# Altium schematic sheet PAGE03_机场端单片机.SchDoc
size A4
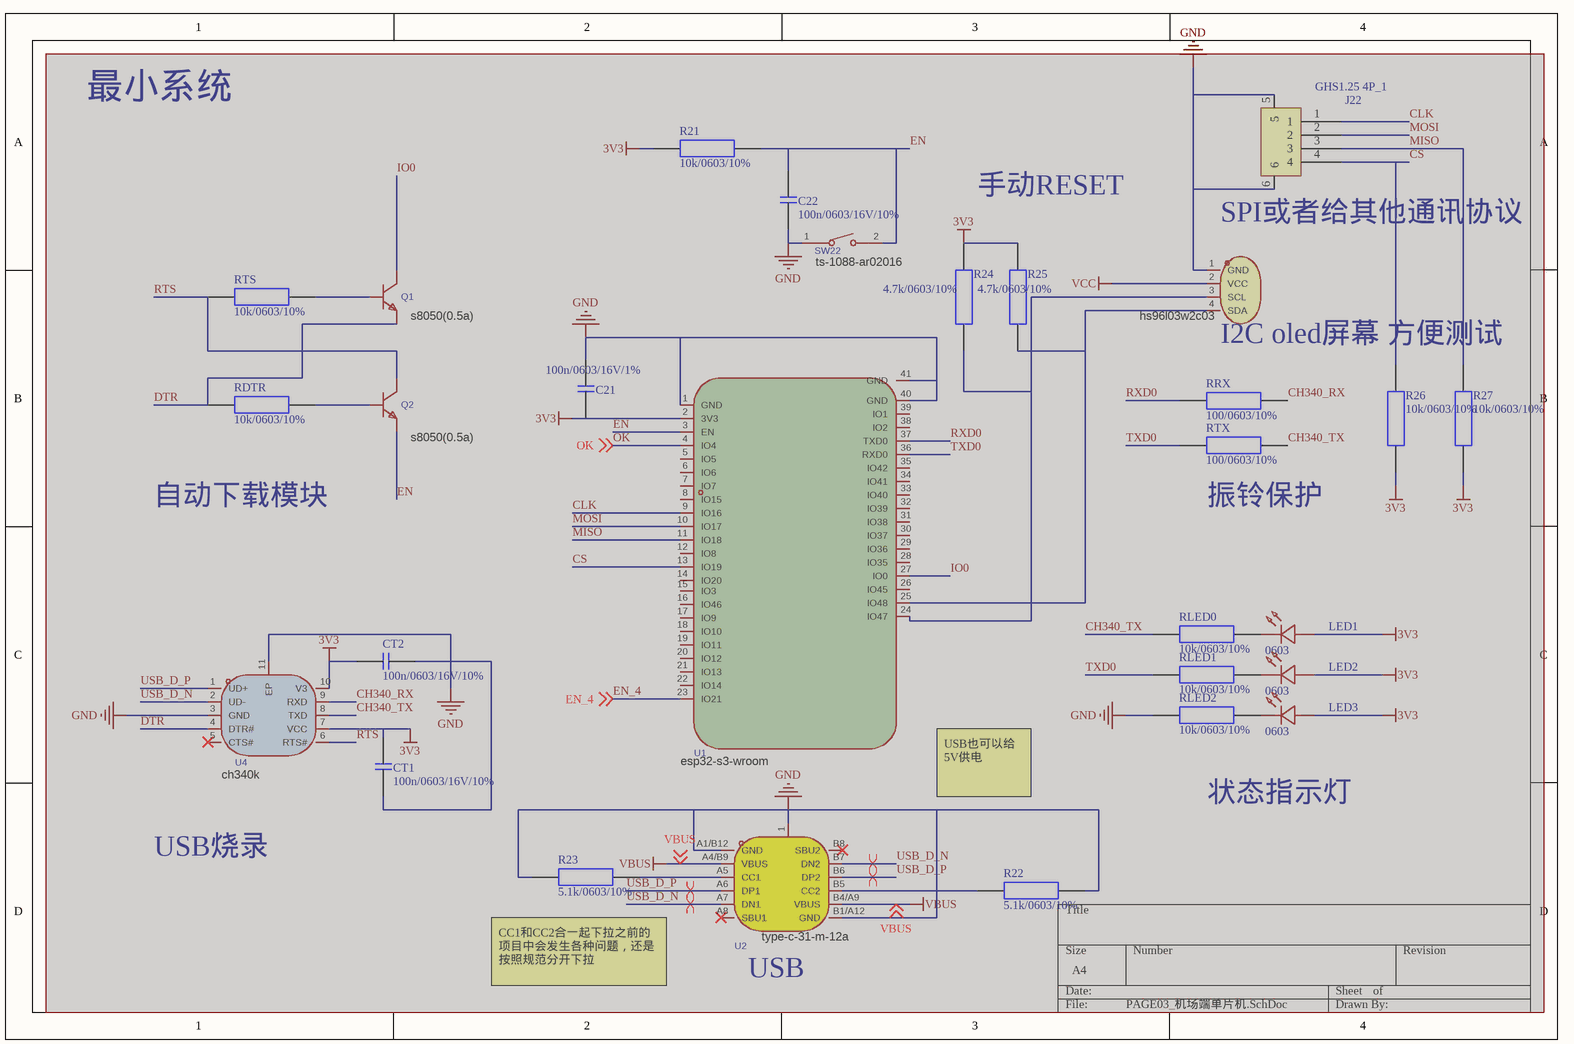
[diagram p0: PAGE03_机场端单片机.SchDoc]

## Parts
C21  100n/0603/16V/1%  [0603_ding_C]  (masked out: inside a compile mask, not in the netlist)
C22  100n/0603/16V/10%  [0603_ding_C]  (masked out: inside a compile mask, not in the netlist)
CT1  100n/0603/16V/10%  [0603_ding_C]  (masked out: inside a compile mask, not in the netlist)
CT2  100n/0603/16V/10%  [0603_ding_C]  (masked out: inside a compile mask, not in the netlist)
J22  GHS1.25 4P_1  [SM04B-GHS卧式]  (masked out: inside a compile mask, not in the netlist)
LED1  0603  [LED0603-RD_GREEN]  (masked out: inside a compile mask, not in the netlist)
LED2  0603  [LED0603-RD_GREEN]  (masked out: inside a compile mask, not in the netlist)
LED3  0603  [LED0603-RD_GREEN]  (masked out: inside a compile mask, not in the netlist)
Q1  s8050(0.5a)  [SOT-23-3_L2.9-W1.3-P1.90-LS2.4-BR]  (masked out: inside a compile mask, not in the netlist)
Q2  s8050(0.5a)  [SOT-23-3_L2.9-W1.3-P1.90-LS2.4-BR]  (masked out: inside a compile mask, not in the netlist)
R21  10k/0603/10%  [0603_ding_R]  (masked out: inside a compile mask, not in the netlist)
R22  5.1k/0603/10%  [0603_ding_R]  (masked out: inside a compile mask, not in the netlist)
R23  5.1k/0603/10%  [0603_ding_R]  (masked out: inside a compile mask, not in the netlist)
R24  4.7k/0603/10%  [0603_ding_R]  (masked out: inside a compile mask, not in the netlist)
R25  4.7k/0603/10%  [0603_ding_R]  (masked out: inside a compile mask, not in the netlist)
R26  10k/0603/10%  [0603_ding_R]  (masked out: inside a compile mask, not in the netlist)
R27  10k/0603/10%  [0603_ding_R]  (masked out: inside a compile mask, not in the netlist)
RDTR  10k/0603/10%  [0603_ding_R]  (masked out: inside a compile mask, not in the netlist)
RLED0  10k/0603/10%  [0603_ding_R]  (masked out: inside a compile mask, not in the netlist)
RLED1  10k/0603/10%  [0603_ding_R]  (masked out: inside a compile mask, not in the netlist)
RLED2  10k/0603/10%  [0603_ding_R]  (masked out: inside a compile mask, not in the netlist)
RRX  100/0603/10%  [0603_ding_R]  (masked out: inside a compile mask, not in the netlist)
RTS  10k/0603/10%  [0603_ding_R]  (masked out: inside a compile mask, not in the netlist)
RTX  100/0603/10%  [0603_ding_R]  (masked out: inside a compile mask, not in the netlist)
SW22  ts-1088-ar02016  [SW-SMD_L3.9-W3.0-P4.45]  (masked out: inside a compile mask, not in the netlist)
U1  esp32-s3-wroom  [WIRELM-SMD_ESP32-S3-WROOM-1]  (masked out: inside a compile mask, not in the netlist)
U2  type-c-31-m-12a  [USB-C-SMD_TYPE-C-31-M-12A]  (masked out: inside a compile mask, not in the netlist)
U4  ch340k  [ESOP-10_L4.9-W3.9-P1.00-LS6.2-BL-EP]  (masked out: inside a compile mask, not in the netlist)
U22  hs96l03w2c03  [OLED-TH_L27.8-W27.2-P2.54_C9900033791]  (masked out: inside a compile mask, not in the netlist)

## Layout directives
differential pair: (no net found under the mark)

## Notes on the sheet
- 最小系统
- 手动RESET
- (near J22) SPI或者给其他通讯协议
- (near U22) I2C oled屏幕 方便测试
- 自动下载模块
- (near RTX) 振铃保护
- (near U1) USB也可以给5V供电
- USB烧录
- 状态指示灯
- (near R23) CC1和CC2合一起下拉之前的项目中会发生各种问题，还是按照规范分开下拉
- (near U2) USB

## Library data of the parts
C21 C22 CT1 CT2 = C
J22 = GHS1.25 4P_1: 卧式短边
LED1-LED3 = LED0603
Q1 Q2 = s8050(0.5a): 晶体管类型:NPN;集电极电流(Ic):500mA;集射极击穿电压(Vceo):25V;耗散功率(Pd):300mW;直流电流增益(hFE):120;; Manufacturer: EIC; AddInBom: yes; ModelId: c62791f0466c4ae2a892c056b845b0ca; ModelName: SOT-23-3P_L2.9-W1.3-H1.0-LS2.4-P0.95; ModelTransform: 98.425,114.173,0,180,0,0,0.0005,-0.0005,0; type: NPN; Current - Collector(Ic): 500mA; Collector - Emitter Voltage VCEO: 25V; Pd - Power Dissipation: 300mW; DC Current Gain: 120; Transition frequency(fT): 150MHz; Current - Collector Cutoff: 100nA; Vce Saturation(VCE(sat)): 600mV; Emitter-Base Voltage(Vebo): 5V; Number: 1个NPN; Symbol: S8050(0.5A); LCSC Part Name: 电流:0.5A 电压:25V; SupplierPart: C3014350; ManufacturerPart: S8050(0.5A); Supplier Footprint: SOT-23; JLCPCB Part Class: Extended Part; Datasheet: https://item.szlcsc.com/datasheet/S8050(0.5A)/3524496.html; Supplier: LCSC; ConvertToPcb: yes; FootprintName: SOT-23-3_L2.9-W1.3-P1.90-LS2.4-BR
R21-R27 RDTR RLED0-RLED2 RRX RTS RTX = RES
SW22 = ts-1088-ar02016: 电路结构:单刀单掷;按钮形状:圆形按钮;作用力:1.6N;安装方式:立贴;开关长度:3.9mm;开关宽度:3mm;开关高度:2mm;带支架:不带支架;触点电流:50mA;额定电压:12V;带灯:-;工作寿命:10万次;; Manufacturer: XUNPU(讯普); AddInBom: yes; ModelId: b26698b69f274ffabef8a26c7d0e5dd1; ModelName: SW-SMD_L3.9-W2.9-H2.0-LS4.8; ModelTransform: 188.976,114.174,0,0,0,0,0,0,0; Circuit: 单刀单掷; Actuator Style: 圆形按钮; Operating Force: 1.6N; Switch Height: 2mm; with Bracket: 不带支架; Contact Current: 50mA; Voltage Rating: 12V; Actuator/Cap Color: 黑色; Life: 10万次; Symbol: TS-1088-AR02016; LCSC Part Name: 3.9*3*2mm 立贴 轻触开关; SupplierPart: C720477; ManufacturerPart: TS-1088-AR02016; Supplier Footprint: SMD,4x3mm; JLCPCB Part Class: Basic Part; Datasheet: https://item.szlcsc.com/datasheet/TS-1088-AR02016/763484.html; Supplier: LCSC; ConvertToPcb: yes; FootprintName: SW-SMD_L3.9-W3.0-P4.45; Mounting Type: 立贴; Length: 3.9mm; Width: 3mm; With Lamp: -; IP Rating: -; Termination Style: SMD接片; Operating Temperature: -30℃~+80℃
U1 = esp32-s3-wroom-1-n16r8: 核心芯片:ESP32-S3R8;频率:2.4GHz;天线形式:板载PCB天线;发射功率:20.5dBm;接收灵敏度:-103.5dBm;; Manufacturer: ESPRESSIF(乐鑫); Symbol: ESP32-S3-WROOM-1(N16R8); AddInBom: yes; ModelId: 481f5bdfc076422c9bb3c23c3ada9c17; ModelTransform: 708.73866,1003.97437,0,0,0,0,0,143.7,0; Interface Type: I2C；GPIO；UART；SPI；USB；I2S; Value: 2.4GHz; Voltage - Supply: 3V~3.6V; Receive  Current: 95mA; Send  Current: 355mA; LCSC Part Name: 不带固件 通用型Wi-Fi+低功耗蓝牙MCU模组; SupplierPart: C2913202; ManufacturerPart: ESP32-S3-WROOM-1-N16R8; Supplier Footprint: SMD,25.5x18mm; JLCPCB Part Class: Extended Part; Datasheet: https://item.szlcsc.com/datasheet/ESP32-S3-WROOM-1-N16R8/3198300.html; Supplier: LCSC; ConvertToPcb: yes; FootprintName: WIRELM-SMD_ESP32-S3-WROOM-1; ModelName: WIRELM-SMD_ESP32-S3-WROOM-1; Utilized IC / Part: ESP32-S3R8; Antenna Type: 板载PCB天线; Output Power: 20.5dBm; Sensitivity: -103.5dBm; Operating Temperature: -40℃~+65℃
U2 = type-c-31-m-12a: 连接器类型:Type-C;公母:母;安装方式:卧贴;触点数量:16P;端口数量:1;额定电流 - 电源:6A;工作温度:-30℃~+85℃;; Manufacturer: 韩国韩荣; AddInBom: yes; ModelId: 5328bfb13ed649e8a9ad528bb3d92809; ModelTransform: 351.9678,305.1175,0,0,0,0,0,-41.575,-39.37; Connector Type: Type-C; Gender: 母; Number of Contacts: 16P; Number of Ports: 1; Current Rating-Power: 6A; Voltage Rating: 20V; Connect-Disconnect Life: 1万次; Symbol: TYPE-C-31-M-12A; LCSC Part Name: Type-C 母 卧贴; SupplierPart: C5337088; ManufacturerPart: TYPE-C-31-M-12A; Supplier Footprint: SMD; JLCPCB Part Class: Extended Part; Datasheet: https://item.szlcsc.com/datasheet/TYPE-C-31-M-12A/6102654.html; Supplier: LCSC; ConvertToPcb: yes; FootprintName: USB-C-SMD_TYPE-C-31-M-12A; ModelName: USB-C-SMD_TYPE-C-31-M-12A; Mounting Type: 卧贴; Length: 7.35mm; Operating Temperature: -30℃~+85℃
U4 = ch340k: 应用功能:USB转串口;USB协议版本:USB 2.0;通道数:-;数据速率:2Mbps;; Manufacturer: WCH(南京沁恒); AddInBom: yes; ModelId: 154218974c894ddbb70273feac157d69; ModelName: ESOP-10_L4.9-W3.9-H1.4-P1.00-LS6.2-BL-EP; ModelTransform: 192.913,242.1255,0,0,0,0,0,0,0; Applications Function: USB转串口; USB Protocol: USB 2.0; Voltage - Supply: 3.3V；5V; Data Rate: 2Mbps; Symbol: CH340K; LCSC Part Name: USB转串口芯片CH340; SupplierPart: C968586; ManufacturerPart: CH340K; Supplier Footprint: ESSOP-10-150mil-1mm; JLCPCB Part Class: Extended Part; Datasheet: https://item.szlcsc.com/datasheet/CH340K/1056391.html; Supplier: LCSC; ConvertToPcb: yes; FootprintName: ESOP-10_L4.9-W3.9-P1.00-LS6.2-BL-EP; Number of Channels: -; Operating Temperature: -20℃~+70℃; Features: 可编程波特率；内置时钟发生器；断电保护；上电复位
U22 = hs96l03w2c03: 主控芯片:SSD1315芯片;接口类型:I2C;尺寸(inch):0.96;像素分辨率:128x64;; Manufacturer: HS(汉昇); AddInBom: yes; ModelId: bb65183306db4ca69fb52250be49b00e; ModelTransform: 1070.864,1094.486,0,0,0,0,0,-498.424,0; Interface: I2C; Dot Pixels: 128x64; Type of Drive: 无源(PMOLED); Display Range: 21.744x10.864mm; Display Color: 白色; Luminance: 180cd/m2; Symbol: HS96L03W2C03; LCSC Part Name: 0.96寸OLED显示屏窄白光IIC; SupplierPart: C5248080; ManufacturerPart: HS96L03W2C03; Supplier Footprint: -; JLCPCB Part Class: Extended Part; Datasheet: https://item.szlcsc.com/datasheet/HS96L03W2C03/5960631.html; Supplier: LCSC; ConvertToPcb: yes; FootprintName: OLED-TH_L27.8-W27.2-P2.54_C9900033791; ModelName: OLED-TH_L27.8-W27.2-P2.54_C9900033791; Controller Type: SSD1315芯片; Size: 0.96; Operating Temperature: -40℃~+70℃; Function: -; Quiescent Current: -